# Altium schematic sheet smartStaircaseLighting.SchDoc: Smart Staircase Lighting
size A4; DrawnBy: De Bruyn Mauro
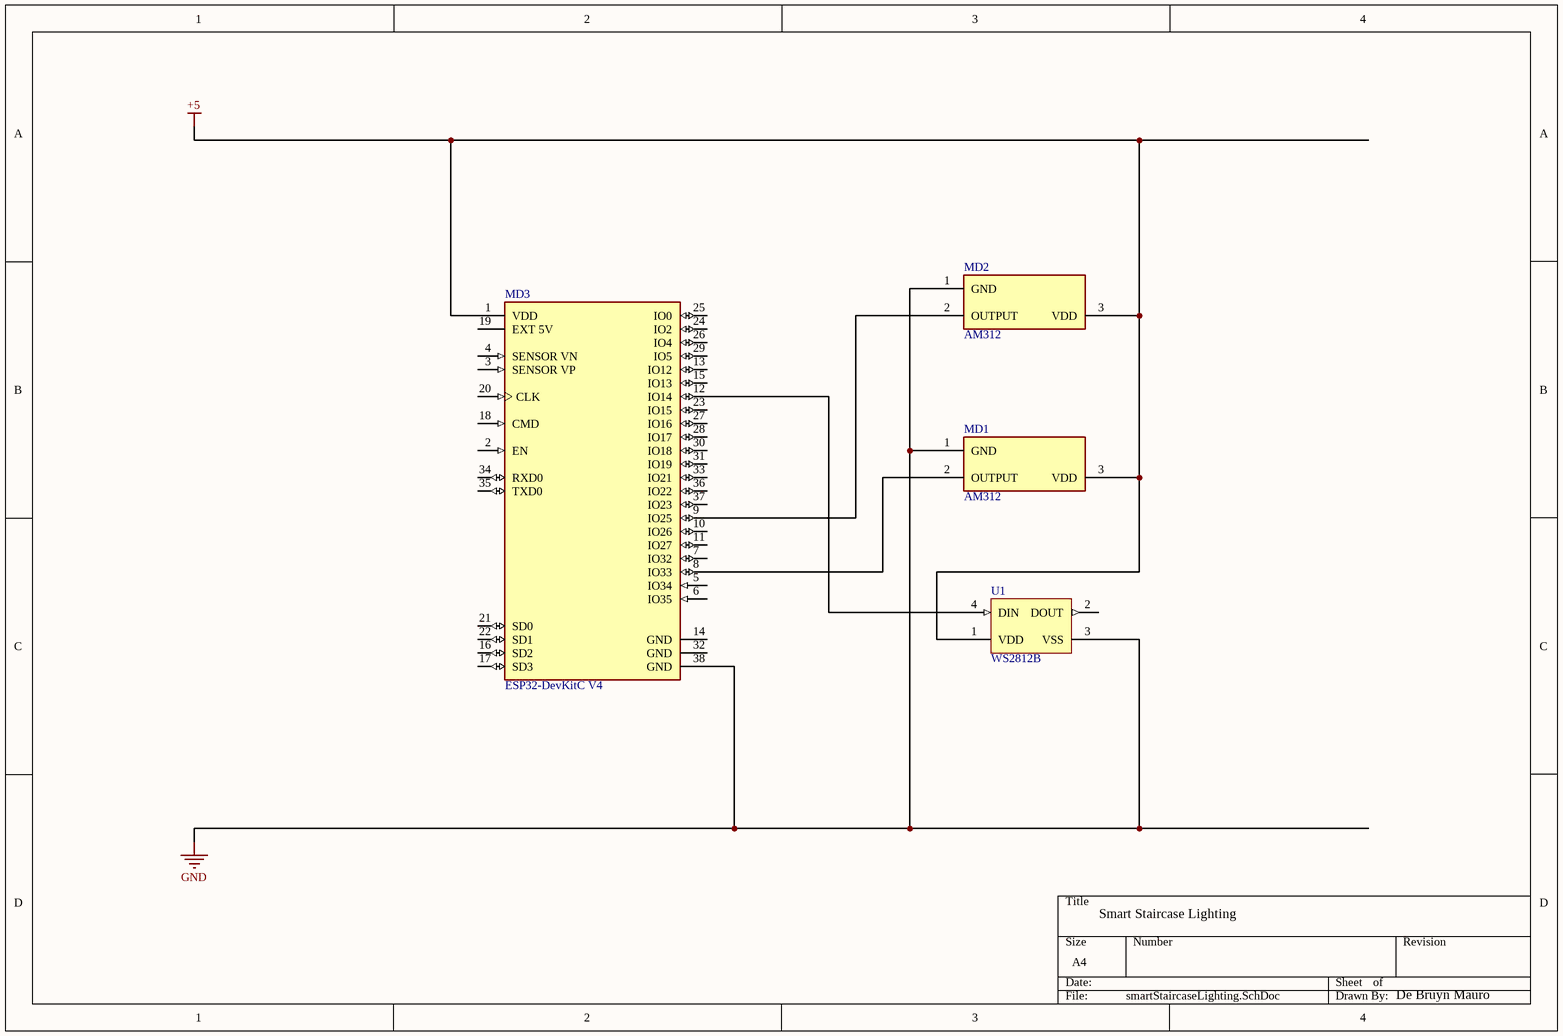
[diagram p0: smartStaircaseLighting.SchDoc]

## Parts
MD1  AM312  [FP-EKMC1603111-MFG]
MD2  AM312  [FP-EKMC1603111-MFG]
MD3  ESP32-DevKitC V4  [FP-ESP32-DevKitC_V4-MFG]
U1  WS2812B  [ADA-RGB-1655_V]

## Nets
+5: MD1.3(VDD) MD2.3(VDD) MD3.1(VDD) U1.1(VDD)
GND: MD1.1(GND) MD2.1(GND) MD3.38(GND) U1.3(VSS)
NetMD1_2: MD1.2(OUTPUT) MD3.8(IO33)
NetMD2_2: MD2.2(OUTPUT) MD3.9(IO25)
NetMD3_12: MD3.12(IO14) U1.4(DIN)

Not connected (* = marked no-connect by the designer): MD3 2(EN) 3(SENSOR_VP) 4(SENSOR_VN) 5(IO34) 6(IO35) 7(IO32) 10(IO26) 11(IO27) 13(IO12) 14(GND) 15(IO13) 16(SD2) 17(SD3) 18(CMD) 19(EXT_5V) 20(CLK) 21(SD0) 22(SD1) 23(IO15) 24(IO2) 25(IO0) 26(IO4) 27(IO16) 28(IO17) 29(IO5) 30(IO18) 31(IO19) 32(GND) 33(IO21) 34(RXD0) 35(TXD0) 36(IO22) 37(IO23); U1 2(DOUT)

## Library data of the parts
MD1 MD2 = CMP-05541-000003-1: SENSOR MOTION PIR; Manufacturer: Panasonic Electric Works; Manufacturer Part Number: EKMC1603111; Sensor Output: TTL; Min Supply Voltage: 3V; Max Supply Voltage: 6V; Operating Supply Current: 170uA; Description: ELECTRIC WORKS PIR Sensor, PaPIRS, Digital, White, 12 m, 3 VDC, 6 VDC, 102 , EKMC Series; Lead Free: Yes; Ambient Temperature Range Low: -20°C; Height: 20.2mm; Digikey Description: SENSOR MOTION PIR 12M RANGE WHT; Device Class L3: unset; Device Class L2: Motion Sensors; Mouser Description: Board Mount Motion & Position Sensors 170uA 12m Digital White Lens; ComponentLink2Description: Datasheet; Ambient Temperature Range High: +60°C; Octopart: https://octopart.com/ekmc1603111-panasonic-19688870; RoHS: TRUE; Device Class L1: Sensors; ComponentLink2URL: https://na.industrial.panasonic.com/file-download/4524; Package: 0; Automotive: No; Category: UNK
MD3 = CMP-194065-000004-1: WiFi Development Tools (802.11) ESP32 General Development Kit, ESP32-WROOM-32 on the board; Manufacturer: Espressif; Number Of Adc Channels: 16; Max Supply Voltage: 5V; Bandwidth: 2.4-2.5GHz; Interface: I2C,SPI,UART,I2S; Max Frequency: 2.5GHz; Min Supply Voltage: 2.7V; Number Of Gpio: 22; Package: ESP32-DevKitC V4; Device Class L2: RF Semiconductors and Devices; Device Class L3: Transceivers; ComponentLink2Description: Datasheet; Temperature Range Low: -40°C; ComponentLink2URL: https://docs.espressif.com/projects/esp-idf/en/latest/get-started/get-started-devkitc.html; RoHS: TRUE; Category: UNK; Automotive: No; Device Class L1: Integrated Circuits (ICs); Manufacturer Part Number: ESP32-DevKitC V4; Octopart: https://octopart.com/esp32-devkitc+v4-espressif+systems-107467262; Lead Free: Yes; Temperature: -40°C to
U1 = CMP-2000-05026-1: Adressable LED strip WS2812B; Manufacturer: Adafruit-Industries-LLC; Number of LEDs: 10; Configuration: Discrete; Utilized LED: WS2812(5050); Datasheet URL: http://datasheet.octopart.com/ADA1655-Adafruit-Industries-datasheet-32028139.pdf; Series: Neopixel; Interface: -; Package Description: 4-Pin Surface Mount Device, Body 5 x 5 mm; Color: Red,Green,Blue(RGB); Category: Optoelectronics; Controller Type: -; Package Reference: 1655; Manufacturer URL: https://www.adafruit.com/; Mounting Type: SurfaceMount; Datasheet Version: May-13; Size / Dimension: 5.00mmLx5.00mmW; Family: Addressable,Specialty